# EAGLE design beechainuino (EAGLE 8.3.0)
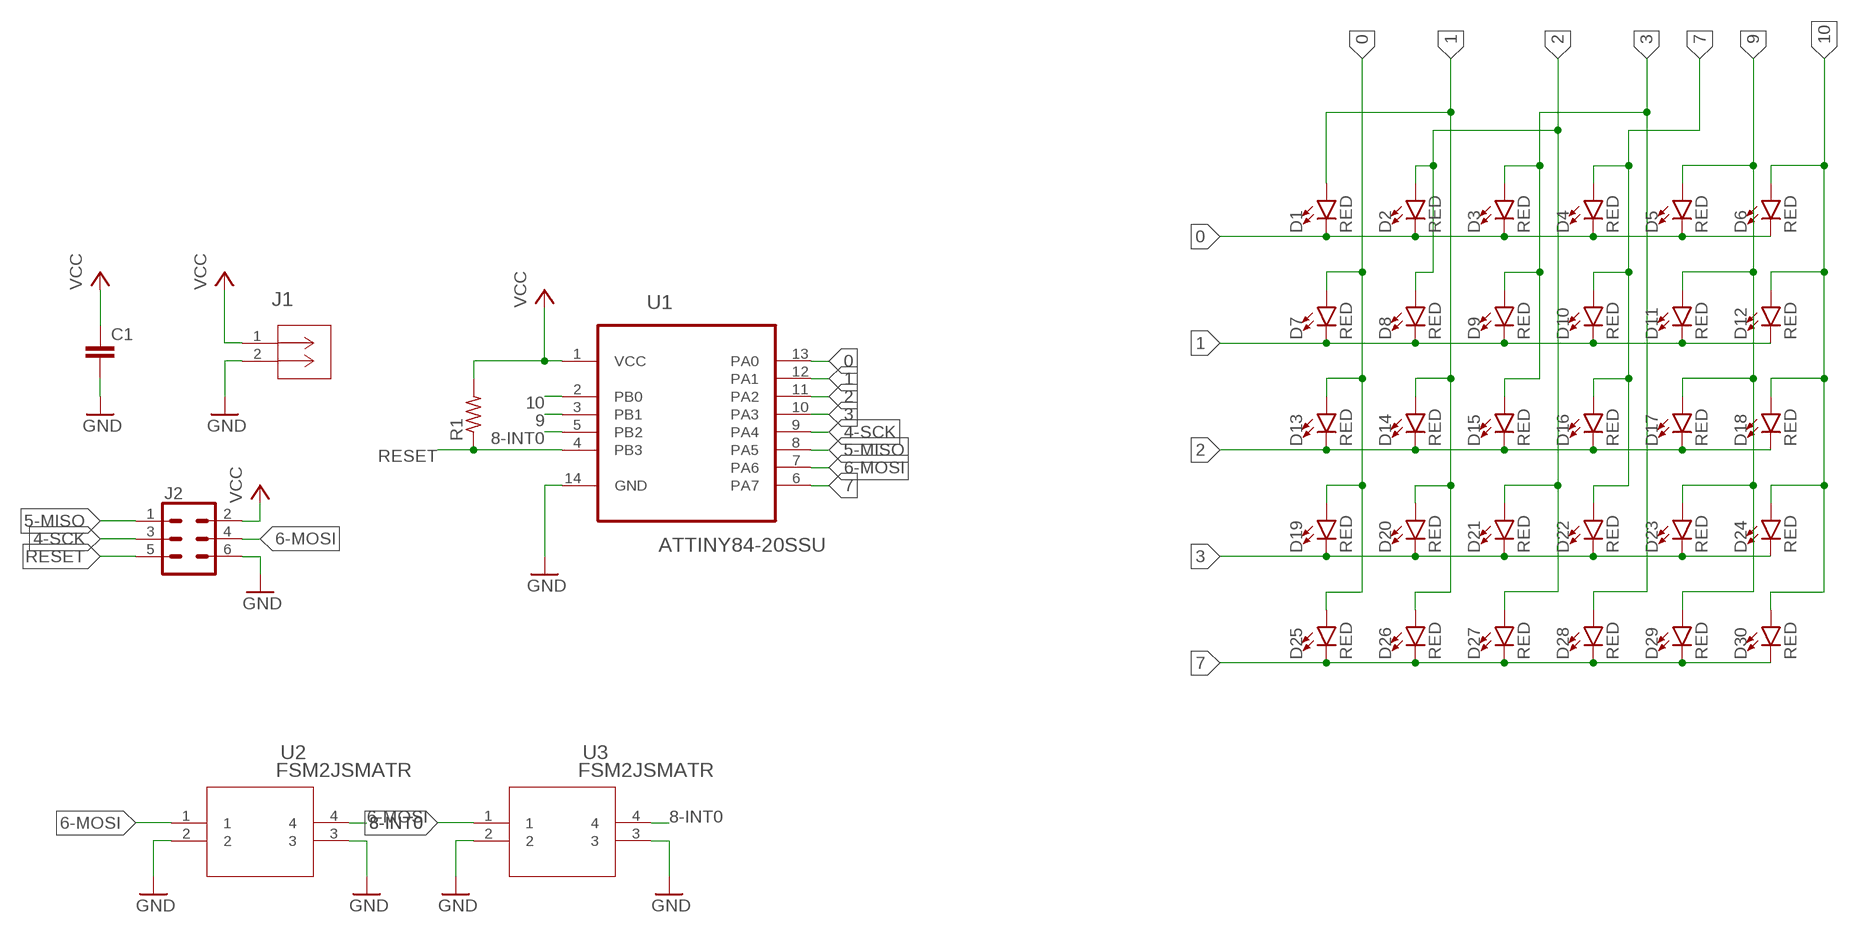
[diagram p0: schematic, sheet 1]

## Parts
C1  C-EUC0603K  [C0603K]
D1  RED  LED-RED0603  [LED-0603]
D2  RED  LED-RED0603  [LED-0603]
D3  RED  LED-RED0603  [LED-0603]
D4  RED  LED-RED0603  [LED-0603]
D5  RED  LED-RED0603  [LED-0603]
D6  RED  LED-RED0603  [LED-0603]
D7  RED  LED-RED0603  [LED-0603]
D8  RED  LED-RED0603  [LED-0603]
D9  RED  LED-RED0603  [LED-0603]
D10  RED  LED-RED0603  [LED-0603]
D11  RED  LED-RED0603  [LED-0603]
D12  RED  LED-RED0603  [LED-0603]
D13  RED  LED-RED0603  [LED-0603]
D14  RED  LED-RED0603  [LED-0603]
D15  RED  LED-RED0603  [LED-0603]
D16  RED  LED-RED0603  [LED-0603]
D17  RED  LED-RED0603  [LED-0603]
D18  RED  LED-RED0603  [LED-0603]
D19  RED  LED-RED0603  [LED-0603]
D20  RED  LED-RED0603  [LED-0603]
D21  RED  LED-RED0603  [LED-0603]
D22  RED  LED-RED0603  [LED-0603]
D23  RED  LED-RED0603  [LED-0603]
D24  RED  LED-RED0603  [LED-0603]
D25  RED  LED-RED0603  [LED-0603]
D26  RED  LED-RED0603  [LED-0603]
D27  RED  LED-RED0603  [LED-0603]
D28  RED  LED-RED0603  [LED-0603]
D29  RED  LED-RED0603  [LED-0603]
D30  RED  LED-RED0603  [LED-0603]
J1  796136-1  [CON2_BATT-HOLDER_SMT]
J2  CONN_03X2FEMALE_SMD  [2X3_SMD]
R1  R-US_R0603  [R0603]
U1  ATTINY84-20SSU  [SOIC127P600X175-14N]
U2  FSM2JSMATR  [SWITCH_FSM2JSMAA]
U3  FSM2JSMATR  [SWITCH_FSM2JSMAA]

## Nets
0: D1.C D2.C D3.C D4.C D5.C D6.C D7.A D13.A D19.A D25.A U1.13(PA0)
1: D1.A D7.C D8.C D9.C D10.C D11.C D12.C D14.A D20.A D26.A U1.12(PA1)
2: D2.A D8.A D13.C D14.C D15.C D16.C D17.C D18.C D21.A D27.A U1.11(PA2)
3: D3.A D9.A D15.A D19.C D20.C D21.C D22.C D23.C D24.C D28.A U1.10(PA3)
4-SCK: J2.3 U1.9(PA4)
5-MISO: J2.1 U1.8(PA5)
6-MOSI: J2.4 U1.7(PA6) U2.1 U2.4
7: D4.A D10.A D16.A D22.A D25.C D26.C D27.C D28.C D29.C D30.C U1.6(PA7)
8-INT0: U1.5(PB2) U3.1 U3.4
9: D5.A D11.A D17.A D23.A D29.A U1.3(PB1)
10: D6.A D12.A D18.A D24.A D30.A U1.2(PB0)
GND: C1.2 J1.2 J2.6 U1.14(GND) U2.2 U2.3 U3.2 U3.3
RESET: J2.5 R1.1 U1.4(PB3)
VCC: C1.1 J1.1 J2.2 R1.2 U1.1(VCC)

## Library data of the parts
C1 = resistor:C-EU: CAPACITOR, European symbol
D1-D30 = SparkFun-LED:LED-RED: Red SMD LED Used in manufacturing of most products at SparkFun Packages: 0603 - SMD 0603 package [Product Link] <http://docs.avagotech.com/docs/AV02-0551EN> 0603 SMART - SMD 0603 SMART package ( more efficient and expensive)[Product Link] <http://www.osram-os.com/Graphics/XPic2/00077099_0.pdf> 1206 - SMD1206 package [Product Link] <https://www.sparkfun.com/datasheets/DevTools/LilyPad/Q150OVS4.pdff> SparkFun Products: Pro Mini 328 -5V <https://www.sparkfun.com/products/821> RedBoard <https://www.sparkfun.com/products/12757> IOIO-OTG <https://www.sparkfun.com/products/13613>; PROD_ID: DIO-00819
J1 = Beeclust:796136-1; MANUFACTURER_PART_NUMBER: 7961361; VENDOR: TE Connectivity
J2 = SparkFun-Connectors:CONN_03X2: Multi connection point. Often used as Generic Header-pin footprint for 0.1 inch spaced/style header connections You can populate with any combo of single row headers, but if you'd like an exact match, check these: Header - 2x3 (Male, 0.1") <https://www.sparkfun.com/products/12807> (PRT-12807) Header - 2x3 (Female, 0.1") <https://www.sparkfun.com/products/13010> (PRT-13010) 2x3 Pin Shrouded Header <https://www.sparkfun.com/products/10877> (PRT-10877) On any of the 0.1 inch spaced packages, you can populate with these: Break Away Headers - Straight <https://www.sparkfun.com/products/116> (PRT-00116) Break Away Male Headers - Right Angle <https://www.sparkfun.com/products/553> (PRT-00553) Female Headers <https://www.sparkfun.com/products/115> (PRT-00115) Break Away Headers - Machine Pin <https://www.sparkfun.com/products/117> (PRT-00117) Break Away Female Headers - Swiss Machine Pin <https://www.sparkfun.com/products/743> (PRT-00743) Special note: the shrouded connector mates well with our 3x2 ribbon cables: Ribbon Crimp Connector - 6-pin (2x3, Female) <https://www.sparkfun.com/products/10651> (PRT-10651) Ribbon Cable - 6 wire (15ft) <https://www.sparkfun.com/products/10646> (PRT-10646); PROD_ID: CONN-11290
R1 = resistor:R-US_: RESISTOR, American symbol
U1 = Atmel_By_element14_Batch_1-00:ATTINY84-20SSU: 8-bit Microcontroller with Bytes In-System Programmable Flash; MPN: ATTINY84-20SSU; OC_FARNELL: 1636955; OC_NEWARK: 03P2040; PACKAGE: SOIC-14; SUPPLIER: Atmel
U2 U3 = Beeclust:FSM2JSMATR; MANUFACTURER_PART_NUMBER: FSM2JSMATR; VENDOR: TE Connectivity

## Board
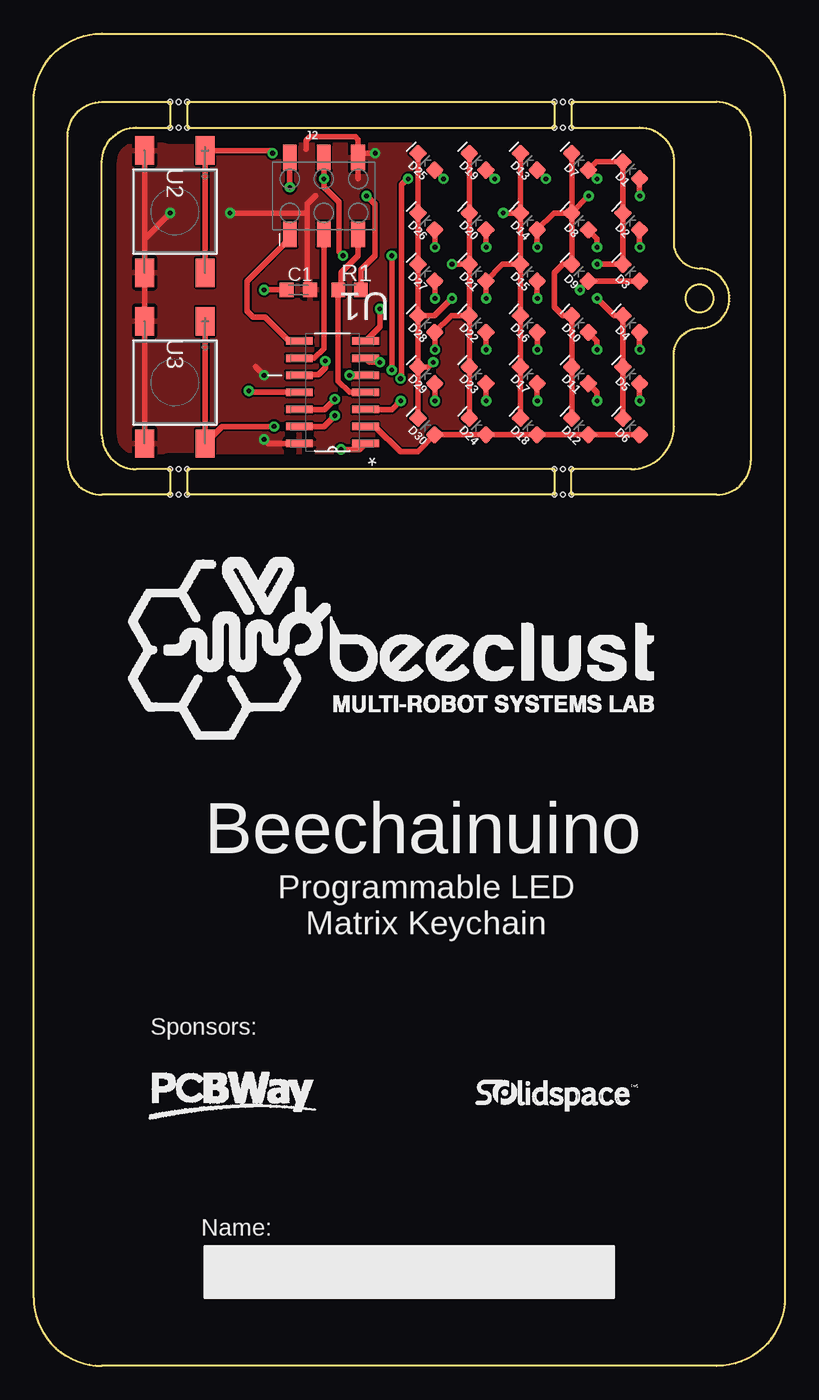
[diagram p1: board, top side]
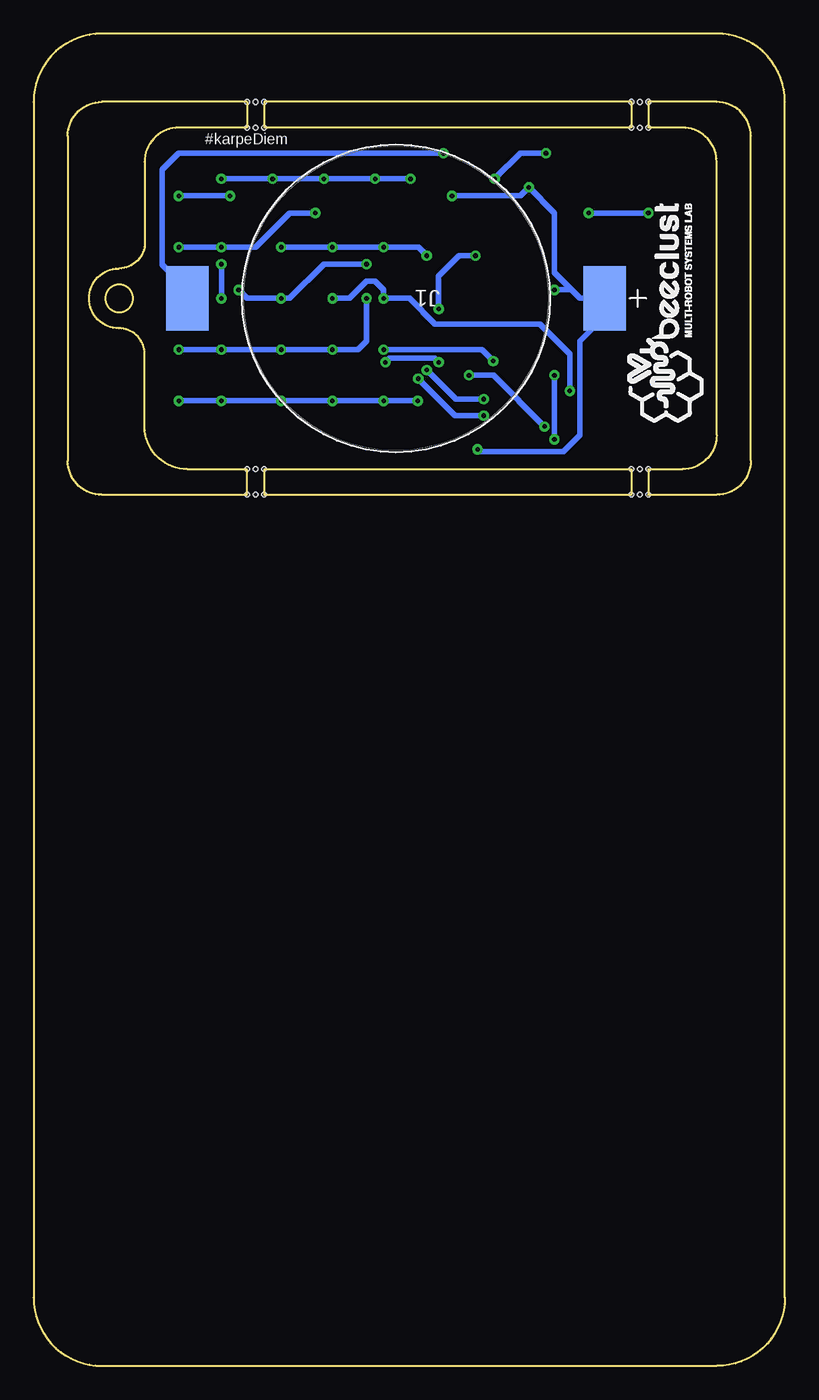
[diagram p2: board, bottom side, seen from below]

Size 55.88 x 99.06 mm. Coordinates in mm from the lower left corner, seen from the top.
Outline: 44.45,66.67 40.01,66.67 40.01,64.77 50.8,64.77 arc90 53.34,67.31 53.34,91.44 arc90 50.8,93.98 40.01,93.98 40.01,92.07 45.09,92.07 arc-90 47.63,89.53 47.63,83.18 arc77 49.53,81.6 arc-180 49.53,77.15 arc90 47.63,75.25 47.63,69.85 arc-90 44.45,66.67
Outline: 38.74,66.67 11.43,66.67 11.43,64.77 38.74,64.77 38.74,66.67
Outline: 10.16,66.67 7.62,66.67 arc-90 5.08,69.22 5.08,89.53 arc-90 7.62,92.07 10.16,92.07 10.16,93.98 5.08,93.98 arc90 2.54,91.44 2.54,67.31 arc90 5.08,64.77 10.16,64.77 10.16,66.67
Outline: 11.43,92.07 38.74,92.07 38.74,93.98 11.43,93.98 11.43,92.07
Outline: 55.88,93.98 55.88,5.08 arc-90 50.8,0 5.08,0 arc-90 0,5.08 0,93.98 arc-90 5.08,99.06 50.8,99.06 arc-90 55.88,93.98
Outline: circle at 49.53,79.38 radius 1
Copper layers (1*16): Top 0.035mm / dielectric 1.5mm / Bottom 0.035mm
Design rules "default *": minimum track width 6mil, minimum drill 0.35mm, track to track 6mil, track to pad 6mil, pad to pad 6mil, via to via 6mil, smd to smd 6mil, copper to edge 40mil, drill to drill 6mil, minimum pad ring 10mil, minimum via ring 8mil, stop-mask expansion 4mil, vias tented up to drill 14mil, thermal gap 10mil
Holes 0.35 mm at 40.01,66.67 39.37,66.67 38.74,66.67 40.01,64.77 39.37,64.77 38.74,64.77 10.16,66.67 11.43,66.67 10.8,66.67 11.43,64.77 10.8,64.77 10.16,64.77 11.43,92.07 11.43,93.98 10.16,93.98 10.16,92.07 10.8,92.07 10.8,93.98 40.01,92.07 40.01,93.98 38.74,93.98 38.74,92.07 39.37,92.07 39.37,93.98

### Footprints (pad centres in the part's own frame; a part is rotated, then mirrored left to right if it is on the bottom)
C0603K = smd 1.05 x 1.08: 1 -0.875,0; 2 0.875,0
LED-0603 = smd 1 x 1: A -0.877,0; C 0.877,0
CON2_BATT-HOLDER_SMT = smd 3.15 x 4.775: 1 -31.039,0; 2 0,0
2X3_SMD = smd 1.02 x 1.9: 1 -2.54,-2.85; 2 -2.54,2.85; 3 0,-2.85; 4 0,2.85; 5 2.54,-2.85; 6 2.54,2.85
R0603 = smd 1 x 1.1: 1 -0.85,0; 2 0.85,0
SOIC127P600X175-14N = smd 1.981 x 0.559: 1 -2.464,3.81; 2 -2.464,2.54; 3 -2.464,1.27; 4 -2.464,0; 5 -2.464,-1.27; 6 -2.464,-2.54; 7 -2.464,-3.81; 8 2.464,-3.81; 9 2.464,-2.54; 10 2.464,-1.27; 11 2.464,0; 12 2.464,1.27; 13 2.464,2.54; 14 2.464,3.81
SWITCH_FSM2JSMAA = smd 2.108 x 1.397: 1 -9.093,4.496; 2 -9.093,0; 3 0,0; 4 0,4.496

### Placement (x,y rotation side)
C1  19.69,80.01 0 top
D1  44.45,88.9 135 top
D2  44.45,85.09 135 top
D3  44.45,81.28 135 top
D4  44.45,77.47 135 top
D5  44.45,73.66 135 top
D6  44.45,69.85 135 top
D7  40.64,89.53 135 top
D8  40.64,85.09 135 top
D9  40.64,81.28 135 top
D10  40.64,77.47 135 top
D11  40.64,73.66 135 top
D12  40.64,69.85 135 top
D13  36.83,89.53 135 top
D14  36.83,85.09 135 top
D15  36.83,81.28 135 top
D16  36.83,77.47 135 top
D17  36.83,73.66 135 top
D18  36.83,69.85 135 top
D19  33.02,89.53 135 top
D20  33.02,85.09 135 top
D21  33.02,81.28 135 top
D22  33.02,77.47 135 top
D23  33.02,73.66 135 top
D24  33.02,69.85 135 top
D25  29.21,89.53 135 top
D26  29.21,85.09 135 top
D27  29.21,81.28 135 top
D28  29.21,77.47 135 top
D29  29.21,73.66 135 top
D30  29.21,69.85 135 top
J1  44.45,79.38 180 bottom
J2  21.59,86.99 0 top
R1  23.49,80.01 0 top
U1  22.23,72.39 180 top
U2  8.26,81.28 270 top
U3  8.26,68.58 270 top
U$1  [PCBWAYLOGO-M]  7.94,15.27 0 top
U$2  [LOGO-M]  5.72,69.85 90 bottom
U$3  [SOLIDSPACELOGO-M]  32.86,18.89 0 top
U$4  [LOGO-L]  6.35,45.72 0 top

### Tracks (layer width: path | path; a pad name or v marks a point on that pad's centre or on a via)
0  (via drill 0.35)
  Top 0.406: D6.C D5.C D4.C 43.2,78.09 v41.91,79.38 | v41.91,81.91 43.82,81.91 D3.C D2.C D1.C 41.87,89.52 D7.A v41.91,88.27 | D13.A v38.1,88.27 | v34.29,88.27 D19.A | v30.48,88.27 D25.A | U1.13 21.59,69.85 v22.4,70.66 | v27.28,73.41 27.28,73.65 27.37,73.74 27.37,87.82 27.89,88.34 27.89,88.3 v27.86,88.27
  Bottom 0.406: v41.91,79.38 v41.91,81.91 | v41.91,88.27 v38.1,88.27 v34.29,88.27 v30.48,88.27 | 27.94,88.27 v30.48,88.27 | v22.4,70.66 24.54,70.66 v27.28,73.41 | v27.86,88.27 v30.48,88.27
1  (via drill 0.35)
  Top 0.406: D12.C D11.C D10.C 40.01,78.1 39.37,78.1 38.74,78.74 38.74,81.28 39.35,81.9 D9.C D8.C | D7.C D8.C | D8.C 38.69,85.71 D14.A 37.45,83.2 v37.46,83.18 | D1.A 45.07,87.01 v45.09,86.99 | D8.C 40.02,85.74 v41.27,86.99 | v29.85,83.18 29.85,84.45 D26.A | D20.A 33.64,83.2 v33.65,83.18 | U1.12 21.64,71.12 v22.4,71.88 | v26.64,82.55 v26.64,74.05
  Bottom 0.406: v45.09,86.99 v41.27,86.99 | v37.46,83.18 v33.65,83.18 v29.85,83.18 27.27,83.18 v26.64,82.55 | v22.4,71.88 24.47,71.88 v26.64,74.05
2  (via drill 0.35)
  Top 0.406: 36.21,85.84 D13.C | 36.21,85.84 D14.C D15.C | D15.C 34.88,81.9 D21.A v33.64,79.39 v33.65,79.38 | D15.C D16.C D17.C D18.C | D2.A 45.07,83.2 v45.09,83.18 | v41.91,83.18 41.91,83.82 D8.A | v29.85,79.38 29.85,80.64 D27.A | v34.93,85.72 36.09,85.72 36.21,85.84 | U1.11 16.1,72.39 v16,72.49
  Bottom 0.406: v45.09,83.18 v41.91,83.18 39.37,83.18 36.83,85.72 v34.93,85.72 | v33.65,79.38 32.38,79.38 31.12,80.64 30.48,80.64 29.85,80.01 v29.85,79.38 27.94,79.38 26.04,77.47 18.24,77.47 16,75.23 v16,72.49
3  (via drill 0.35)
  Top 0.406: D19.C D20.C D21.C | D21.C D22.C | D22.C D23.C D24.C | D22.C 31.07,78.09 D28.A 29.85,76.83 v29.85,75.56 | D3.A D9.A 41.26,80.63 v40.64,80.01 | v31.12,81.91 32.38,81.91 D21.C | D15.A v37.45,79.39 v37.46,79.38 | v21.7,74.72 21.7,74.23 21.18,73.71 19.81,73.71 U1.10
  Bottom 0.406: v31.12,81.91 34.29,81.91 36.83,79.38 v37.46,79.38 40.01,79.38 v40.64,80.01 | v29.85,75.56 22.54,75.56 v21.7,74.72
4-SCK
  Top 0.406: J2.3 21.59,75.65 20.87,74.93 U1.9
5-MISO
  Top 0.406: J2.1 19.05,83.82 15.88,80.64 15.88,78.41 16.31,77.98 17.22,77.98 19,76.2 U1.8
6-MOSI  (via drill 0.35)
  Top 0.406: U2.4 U2.1 17.58,90.37 v17.78,90.17 | J2.4 v21.59,88.27 21.59,87.63 22.71,86.51 22.71,82.85 v23.01,82.55 | v25.76,78.59 25.76,77.27 U1.7
  Bottom 0.406: v17.78,90.17 19.69,90.17 v21.59,88.27 | v23.01,82.55 24.23,82.55 25.76,81.03 v25.76,78.59
7  (via drill 0.35)
  Top 0.406: D25.C D26.C D27.C D28.C | D28.C D29.C | D4.A 45.07,75.58 v45.09,75.56 | v41.91,75.56 41.91,76.2 D10.A | D28.C 29.83,78.09 v31.12,79.38 | v33.65,75.56 33.65,76.83 D22.A | v37.46,75.56 37.46,76.83 D16.A | D29.C D30.C | D29.C 29.37,74.28 v29.72,74.62 | v25.76,74.62 24.99,74.62 U1.6
  Bottom 0.406: v45.09,75.56 v41.91,75.56 v37.46,75.56 v33.65,75.56 31.75,75.56 31.12,76.2 v31.12,79.38 | v29.72,74.62 29.41,74.93 26.06,74.93 v25.76,74.62
8-INT0  (via drill 0.35)
  Top 0.406: U3.1 U3.4 14.02,69.85 v17.88,69.85 | U1.5 v23.49,73.66
  Bottom 0.406: v23.49,73.66 21.69,73.66 v17.88,69.85
9  (via drill 0.35)
  Top 0.406: D5.A 45.07,71.77 v45.09,71.75 | v41.91,71.75 41.91,72.39 D11.A | U1.3 26.67,71.12 v27.3,71.75 | v29.85,71.75 29.85,73.02 D29.A | D17.A v37.45,71.77 v37.46,71.75 | D23.A v33.64,71.77 v33.65,71.75
  Bottom 0.406: v45.09,71.75 v41.91,71.75 v37.46,71.75 v33.65,71.75 v29.85,71.75 v27.3,71.75
10
  Top 0.406: U1.2 25.4,69.85 27.28,67.97 28.57,67.97 D30.A D24.A D18.A D12.A D6.A
GND  (via drill 0.35)
  Top 0.406: U3.3 U3.2 U2.3 8.26,83.79 | 8.26,83.79 U2.2 | v25.4,90.17 24.45,90.17 J2.6 | J2.6 24.13,88.27 | 20.95,86.99 20.32,86.36 20.32,85.72 | 20.32,85.72 20.32,80.25 C1.2 | 16.51,74.29 v17.15,73.66 | 20.32,85.72 v14.61,85.72 | v10.16,85.72 10.16,85.69 8.26,83.79 | U1.14 17.46,68.58 v17.15,68.9 | J2.6 24.13,91.19 23.93,91.39 20.57,91.39 20.27,91.08 20.27,90.47
  Bottom 0.406: J1.2 44.45,80.01 46.33,81.89 46.33,88.92 45.09,90.17 v25.4,90.17 | v17.15,73.66 v17.15,68.9 | v14.61,85.72 v10.16,85.72
  pour Top: 52.07,92.71 3.81,92.71 3.81,66.04 52.07,66.04
RESET
  Top 0.406: J2.5 24.13,82.55 22.86,81.28 22.86,80.22 R1.1 22.65,73.24 23.49,72.39 U1.4
VCC  (via drill 0.35)
  Top 0.406: v19.05,87.63 J2.2 | C1.1 v17.15,80.01 | v22.86,68.14 24.25,68.14 U1.1 | R1.2 24.34,81.49 25.4,82.55 25.4,86.36 v24.77,86.99
  Bottom 0.406: 15.88,80.01 15.24,79.38 J1.1 13.41,78.03 15.24,76.2 15.24,69.22 16.48,67.97 22.69,67.97 v22.86,68.14 | 15.88,80.01 17.15,81.28 17.15,85.72 v19.05,87.63 19.69,86.99 v24.77,86.99 | v17.15,80.01 15.88,80.01

### Text on the board
tPlace: Beechainuino | Programmable LED / Matrix Keychain | Sponsors: | Name:
bPlace: #karpeDiem